# Altium schematic sheet MSP IOboard.SchDoc
size A4
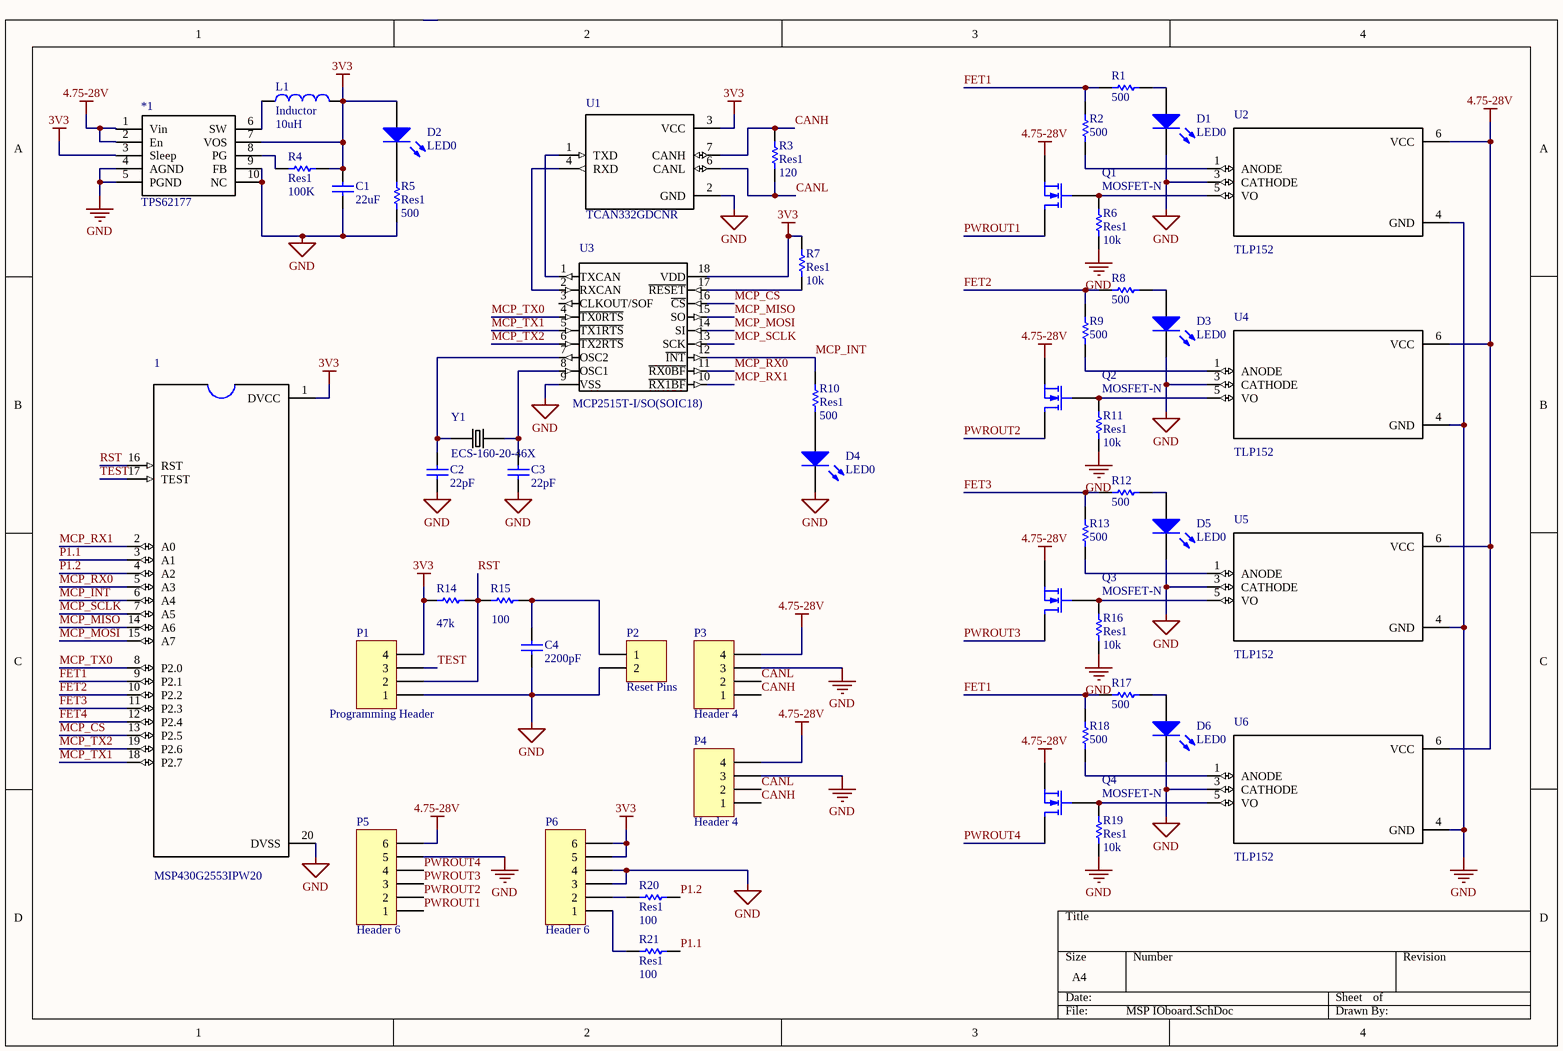
[diagram p0: MSP IOboard.SchDoc]

## Parts
1  MSP430G2553IPW20  [TSSOP-20]
*1  TPS62177  [SON80P400X400X80-10N]
C1  value 22uF  [0603]  (hidden comment: Cap)
C2  value 22pF  [0603]  (hidden comment: Cap)
C3  value 22pF  [0603]  (hidden comment: Cap)
C4  value 2200pF  [0603]  (hidden comment: Cap)
D1  LED0  [0603]
D2  LED0  [0603]
D3  LED0  [0603]
D4  LED0  [0603]
D5  LED0  [0603]
D6  LED0  [0603]
L1  Inductor  value 10uH  [INDC2520X18N]
P1  Programming Header  [HDR1X4]
P2  Reset Pins  [HDR1X2]
P3  Header 4  [HDR1X4]
P4  Header 4  [HDR1X4]
P5  Header 6  [HDR1X6]
P6  Header 6  [HDR1X6]
Q1  MOSFET-N  [SOT95P230X110-3N]
Q2  MOSFET-N  [SOT95P230X110-3N]
Q3  MOSFET-N  [SOT95P230X110-3N]
Q4  MOSFET-N  [SOT95P230X110-3N]
R1  value 500  [RESC2012X70]  (hidden comment: Res1)
R2  value 500  [RESC2012X70]  (hidden comment: Res1)
R3  Res1  value 120  [AXIAL-0.3]
R4  Res1  value 100K  [RESC2012X70]
R5  Res1  value 500  [RESC2012X70]
R6  Res1  value 10k  [RESC2012X70]
R7  Res1  value 10k  [RESC2012X70]
R8  value 500  [RESC2012X70]  (hidden comment: Res1)
R9  value 500  [RESC2012X70]  (hidden comment: Res1)
R10  Res1  value 500  [RESC2012X70]
R11  Res1  value 10k  [RESC2012X70]
R12  value 500  [RESC2012X70]  (hidden comment: Res1)
R13  value 500  [RESC2012X70]  (hidden comment: Res1)
R14  value 47k  [RESC2012X70]  (hidden comment: Res1)
R15  value 100  [RESC2012X70]  (hidden comment: Res1)
R16  Res1  value 10k  [RESC2012X70]
R17  value 500  [RESC2012X70]  (hidden comment: Res1)
R18  value 500  [RESC2012X70]  (hidden comment: Res1)
R19  Res1  value 10k  [RESC2012X70]
R20  Res1  value 100  [RESC2012X70]
R21  Res1  value 100  [RESC2012X70]
U1  TCAN332GDCNR  [SOT65P280X145-8N]
U2  TLP152  [SOIC127P375X700X220-5N]
U3  MCP2515T-I/SO(SOIC18)  [SOIC18-1.27-11.5X7.5MM]
U4  TLP152  [SOIC127P375X700X220-5N]
U5  TLP152  [SOIC127P375X700X220-5N]
U6  TLP152  [SOIC127P375X700X220-5N]
Y1  ECS-160-20-46X  [XTAL_ECS-160-20-46X]

## Nets
3V3: 1.1(DVCC) *1.3(Sleep) *1.7(VOS) C1.2 D2.1(A) L1.2 P1.4 P6.5 P6.6 R4.1 R7.2 R14.1 U1.3(VCC) U3.18(VDD)
4.75-28V: *1.1(Vin) *1.2(En) P3.4 P4.4 P5.6 Q1.3(S) Q2.3(S) Q3.3(S) Q4.3(S) U2.6(VCC) U4.6(VCC) U5.6(VCC) U6.6(VCC)
GND: 1.20(DVSS) *1.4(AGND) *1.5(PGND) *1.9(FB) *1.10(NC) C1.1 C2.1 C3.1 C4.1 D1.2(K) D3.2(K) D4.2(K) D5.2(K) D6.2(K) P1.1 P2.2 P3.3 P4.3 P5.5 P6.3 P6.4 R5.2 R6.1 R11.1 R16.1 R19.1 U1.2(GND) U2.3(CATHODE) U2.4(GND) U3.9(VSS) U4.3(CATHODE) U4.4(GND) U5.3(CATHODE) U5.4(GND) U6.3(CATHODE) U6.4(GND)
CANH: P3.1 P4.1 R3.2 U1.7(CANH)
CANL: P3.2 P4.2 R3.1 U1.6(CANL)
FET1: 1.9(P2.1) R1.1 R2.2 R17.2 R18.1
FET2: 1.10(P2.2) R8.1 R9.1
FET3: 1.11(P2.3) R12.2 R13.1
FET4: 1.12(P2.4)
MCP_CS: 1.13(P2.5) U3.16(~{CS})
MCP_INT: 1.6(A4) R10.2 U3.12(~{INT})
MCP_MISO: 1.14(A6) U3.15(SO)
MCP_MOSI: 1.15(A7) U3.14(SI)
MCP_RX0: 1.5(A3) U3.11(~{RX0BF})
MCP_RX1: 1.2(A0) U3.10(~{RX1BF})
MCP_SCLK: 1.7(A5) U3.13(SCK)
MCP_TX0: 1.8(P2.0) U3.4(~{TX0RTS})
MCP_TX1: 1.18(P2.7) U3.5(~{TX1RTS})
MCP_TX2: 1.19(P2.6) U3.6(~{TX2RTS})
P1.1: 1.3(A1) R21.1
P1.2: 1.4(A2) R20.1
PWROUT1: P5.1 Q1.1(D)
PWROUT2: P5.2 Q2.1(D)
PWROUT3: P5.3 Q3.1(D)
PWROUT4: P5.4 Q4.1(D)
RST: 1.16(RST) P1.2 R14.2 R15.1
TEST: 1.17(TEST) P1.3
Net*1_6: *1.6(SW) L1.1
Net*1_8: *1.8(PG) R4.2
NetC2_2: C2.2 U3.7(OSC2) Y1.1
NetC3_2: C3.2 U3.8(OSC1) Y1.2
NetC4_2: C4.2 P2.1 R15.2
NetD1_1: D1.1(A) R1.2
NetD2_2: D2.2(K) R5.1
NetD3_1: D3.1(A) R8.2
NetD4_1: D4.1(A) R10.1
NetD5_1: D5.1(A) R12.1
NetD6_1: D6.1(A) R17.1
NetP6_1: P6.1 R21.2
NetP6_2: P6.2 R20.2
NetQ1_2: Q1.2(G) R6.2 U2.5(VO)
NetQ2_2: Q2.2(G) R11.2 U4.5(VO)
NetQ3_2: Q3.2(G) R16.2 U5.5(VO)
NetQ4_2: Q4.2(G) R19.2 U6.5(VO)
NetR2_1: R2.1 U2.1(ANODE)
NetR7_1: R7.1 U3.17(~{RESET})
NetR9_2: R9.2 U4.1(ANODE)
NetR13_2: R13.2 U5.1(ANODE)
NetR18_2: R18.2 U6.1(ANODE)
NetU1_1: U1.1(TXD) U3.1(TXCAN)
NetU1_4: U1.4(RXD) U3.2(RXCAN)

Not connected (* = marked no-connect by the designer): U3 3(CLKOUT/SOF)

## Library data of the parts
1 = MSP430G2553IPW20: MSP430G2x53, MSP430G2x13 Mixed Signal Microcontroller 20-TSSOP -40 to 85; MF: Texas Instruments; MP: MSP430G2553IPW20; Price: None; Availability: Unavailable; Package: TSSOP-20 Texas Instruments; SnapEDA_Link: https://www.snapeda.com/parts/MSP430G2553IPW20/Texas%20Instruments/view-part/?ref=snap; Value: *
C1-C4 = Cap: Capacitor; Published: 8-Jun-2000; LatestRevisionDate: 17-Jul-2002; LatestRevisionNote: Re-released for DXP Platform.; PackageReference: RAD-0.3; Publisher: Altium Limited; PackageDescription: Radial Cap, Thru-Hole; 2 Leads; 0.3 in Pin Spacing
D1-D6 = LED0: Typical INFRARED GaAs LED; Published: 8-Jun-2000; LatestRevisionDate: 08-Jul-2005; LatestRevisionNote: Mech Layer 1 removed.; PackageReference: LED-0; Publisher: Altium Limited; PackageDescription: LED; 2 Leads
L1 = Inductor: Code_IEC: 1005; Published: 8-Jun-2000; LatestRevisionDate: 29-May-2009; LatestRevisionNote: IPC-7351 Footprint Added.; PackageReference: 0402-A; Publisher: Altium Limited; PackageDescription: Chip Inductor; Code_JEITA: 0402
P1 P3 P4 = Header 4: Header, 4-Pin; LatestRevisionDate: 17-Jul-2002; LatestRevisionNote: Re-released for DXP Platform.; Publisher: Altium Limited
P2 = Header 2: Header, 2-Pin; LatestRevisionDate: 17-Jul-2002; LatestRevisionNote: Re-released for DXP Platform.; Publisher: Altium Limited
P5 P6 = Header 6: Header, 6-Pin; LatestRevisionDate: 17-Jul-2002; LatestRevisionNote: Re-released for DXP Platform.; Publisher: Altium Limited
Q1-Q4 = MOSFET-N: N-Channel MOSFET; Published: 8-Jun-2000; LatestRevisionDate: 17-Jul-2002; LatestRevisionNote: Re-released for DXP Platform.; PackageVersion: 1995/1996; PackageReference: E3; Publisher: Altium Limited; PackageDescription: TO, Flat Index; 3 In-Line, Axial Leads; Body Dia. 4.6mm; Lead Dia. 0.5 mm (max)
R1-R21 = Res1: Resistor; Published: 8-Jun-2000; LatestRevisionDate: 17-Jul-2002; LatestRevisionNote: Re-released for DXP Platform.; PackageReference: AXIAL-0.3; Publisher: Altium Limited; PackageDescription: Axial Device, Thru-Hole; 2 Leads; 0.3 in Pin Spacing
U1 = TCAN332GDCNR: 3.3-V CAN Transceivers with CAN FD _Flexible Data Rate_ 8-SOT-23 -40 to 125; MF: Texas Instruments; MP: TCAN332GDCNR; Price: None; Availability: Unavailable; Package: SOT-23 Texas Instruments; SnapEDA_Link: https://www.snapeda.com/parts/TCAN332GDCNR/Texas%20Instruments/view-part/?ref=snap; Value: *
U2 U4-U6 = TLP152: Optocoupler, Gate Driver, 3.75kv, Smdip; MF: Toshiba; MP: TLP152; Price: None; Availability: Unavailable; Package: SOIC-5 Toshiba; SnapEDA_Link: https://www.snapeda.com/parts/TLP152/Toshiba/view-part/?ref=snap; Value: *
U3 = INTERFACE-MCP2515T-I/SO(SOIC18): MCP2515 Series 5.5 V 1 Mb/s Stand Alone SPI Interface CAN Controller- SOIC-18; MF: Microchip; SnapEDA_Link: https://www.snapeda.com/parts/MCP2515T-I/SO/Microchip/view-part/?ref=snap; MP: MCP2515T-I/SO; Package: SOIC-18 Microchip; Price: None; Availability: Unavailable; Value: *
Y1 = ECS-160-20-46X: Crystal 16MHz Â±30ppm _Tol_ Â±50ppm _Stability_ 20pF FUND 50Ohm; MF: ECS Inc.; Price: None; MP: ECS-160-20-46X; SnapEDA_Link: https://www.snapeda.com/parts/ECS-160-20-46X/ECS%20Inc./view-part/?ref=snap; Availability: Unavailable; Package: HC46/X ECS International; Value: *